# Altium schematic sheet Ethernet1_PoE.SchDoc
size A3; DocumentNumber: 22; SheetNumber: 22; SheetTotal: 47
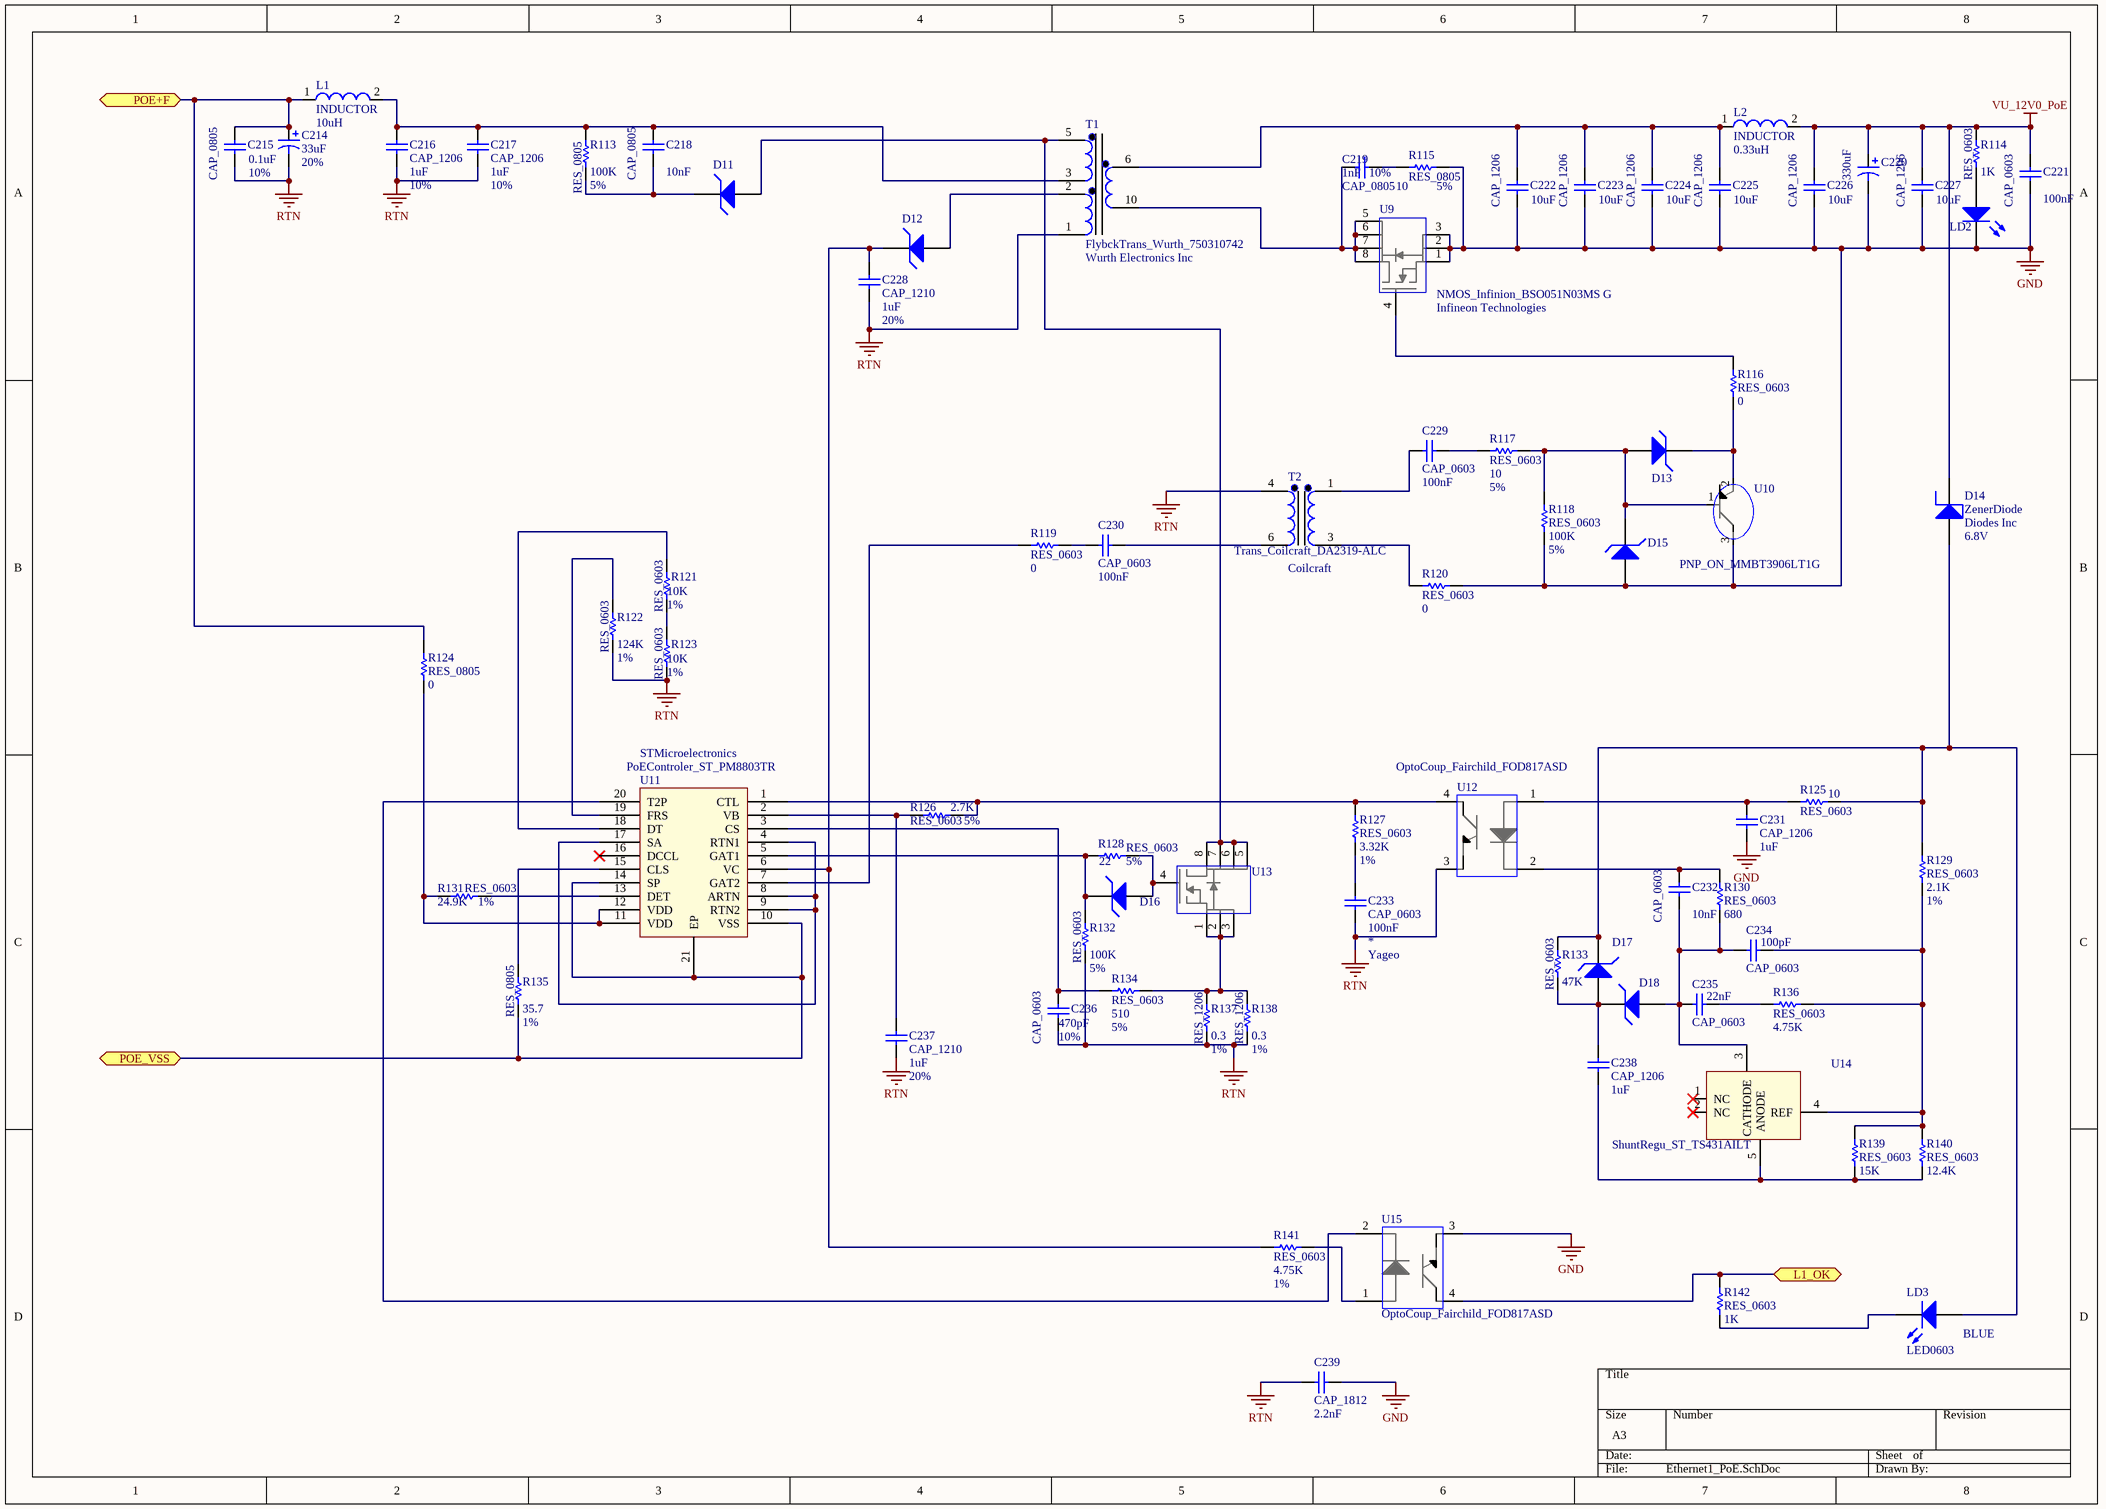
[diagram p0: Ethernet1_PoE.SchDoc]

## Parts
C214  value 33uF  Tolerance: 20%  [CapPol_Al_EEE-2AA330P]  (hidden comment: Cap Pol1)
C215  CAP_0805  value 0.1uF  Tolerance: 10%  [CAPC0805(2012)75_N]
C216  CAP_1206  value 1uF  Tolerance: 10%  [CAPC1206(3216)100_N]
C217  CAP_1206  value 1uF  Tolerance: 10%  [CAPC1206(3216)100_N]
C218  CAP_0805  value 10nF  [CAPC0805(2012)75_N]
C219  CAP_0805  value 1nF  Tolerance: 10%  [CAPC0805(2012)75_N]
C220  value 330uF  [CapPol_Al_PCV1D331MCL2GS]  (hidden comment: Cap Pol1)
C221  CAP_0603  value 100nF  [CAPC0603(1608)100_N]
C222  CAP_1206  value 10uF  [CAPC1206(3216)100_N]
C223  CAP_1206  value 10uF  [CAPC1206(3216)100_N]
C224  CAP_1206  value 10uF  [CAPC1206(3216)100_N]
C225  CAP_1206  value 10uF  [CAPC1206(3216)100_N]
C226  CAP_1206  value 10uF  [CAPC1206(3216)100_N]
C227  CAP_1206  value 10uF  [CAPC1206(3216)100_N]
C228  CAP_1210  value 1uF  Tolerance: 20%  [CAPC1210(3225)100_N]
C229  CAP_0603  value 100nF  [CAPC0603(1608)100_N]
C230  CAP_0603  value 100nF  [CAPC0603(1608)100_N]
C231  CAP_1206  value 1uF  [CAPC1206(3216)100_N]
C232  CAP_0603  value 10nF  [CAPC0603(1608)100_N]
C233  CAP_0603  value 100nF  Manufacturer: Yageo  [CAPC0603(1608)100_N]
C234  CAP_0603  value 100pF  [CAPC0603(1608)100_N]
C235  CAP_0603  value 22nF  [CAPC0603(1608)100_N]
C236  CAP_0603  value 470pF  Tolerance: 10%  [CAPC0603(1608)100_N]
C237  CAP_1210  value 1uF  Tolerance: 20%  [CAPC1210(3225)100_N]
C238  CAP_1206  value 1uF  [CAPC1206(3216)100_N]
C239  CAP_1812  value 2.2nF  [CAPC1812(4532)250_N]
D11  Shottky Diode  [SchottlyDiode_STPS2H100A_SMA]  (value not drawn)
D12  Shottky Diode  [SchottkyDiode_BAT46JFILM]  (value not drawn)
D13  Shottky Diode  [SchottkyDiode_BAT46JFILM]  (value not drawn)
D14  ZenerDiode  value 6.8V  Manufacturer: Diodes Inc  [ZenerDiode_DDZ6V8CSF-7_2-PIN]
D15  Shottky Diode  [SchottkyDiode_BAT46JFILM]  (value not drawn)
D16  Shottky Diode  [SchottkyDiode_BAT46JFILM]  (value not drawn)
D17  Shottky Diode  [SchottkyDiode_BAT46JFILM]  (value not drawn)
D18  Shottky Diode  [SchottkyDiode_BAT46JFILM]  (value not drawn)
L1  INDUCTOR  value 10uH  [Inductor_MSS7341-103MLB_2-PIN]
L2  INDUCTOR  value 0.33uH  [Inductor_DO1813H-181MLB_2-PINS]
LD2  LED0805  [LED0805(2012)]  (value not drawn)
LD3  LED0603  value BLUE  [LED0603(1608)]
R113  RES_0805  value 100K  Tolerance: 5%  [RESC0805(2012)_N]
R114  RES_0603  value 1K  [RESC0603(1608)_N]
R115  RES_0805  value 10  Tolerance: 5%  [RESC0805(2012)_N]
R116  RES_0603  value 0  [RESC0603(1608)_N]
R117  RES_0603  value 10  Tolerance: 5%  [RESC0603(1608)_N]
R118  RES_0603  value 100K  Tolerance: 5%  [RESC0603(1608)_N]
R119  RES_0603  value 0  [RESC0603(1608)_N]
R120  RES_0603  value 0  [RESC0603(1608)_N]
R121  RES_0603  value 10K  Tolerance: 1%  [RESC0603(1608)_N]
R122  RES_0603  value 124K  Tolerance: 1%  [RESC0603(1608)_N]
R123  RES_0603  value 10K  Tolerance: 1%  [RESC0603(1608)_N]
R124  RES_0805  value 0  [RESC0805(2012)_N]
R125  RES_0603  value 10  [RESC0603(1608)_N]
R126  RES_0603  value 2.7K  Tolerance: 5%  [RESC0603(1608)_N]
R127  RES_0603  value 3.32K  Tolerance: 1%  [RESC0603(1608)_N]
R128  RES_0603  value 22  Tolerance: 5%  [RESC0603(1608)_N]
R129  RES_0603  value 2.1K  Tolerance: 1%  [RESC0603(1608)_N]
R130  RES_0603  value 680  [RESC0603(1608)_N]
R131  RES_0603  value 24.9K  Tolerance: 1%  [RESC0603(1608)_N]
R132  RES_0603  value 100K  Tolerance: 5%  [RESC0603(1608)_N]
R133  RES_0603  value 47K  [RESC0603(1608)_N]
R134  RES_0603  value 510  Tolerance: 5%  [RESC0603(1608)_N]
R135  RES_0805  value 35.7  Tolerance: 1%  [RESC0805(2012)_N]
R136  RES_0603  value 4.75K  [RESC0603(1608)_N]
R137  RES_1206  value 0.3  Tolerance: 1%  [RESC1206(3216)_N]
R138  RES_1206  value 0.3  Tolerance: 1%  [RESC1206(3216)_N]
R139  RES_0603  value 15K  [RESC0603(1608)_N]
R140  RES_0603  value 12.4K  [RESC0603(1608)_N]
R141  RES_0603  value 4.75K  Tolerance: 1%  [RESC0603(1608)_N]
R142  RES_0603  value 1K  [RESC0603(1608)_N]
T1  FlybckTrans_Wurth_750310742  Manufacturer: Wurth Electronics Inc  [FlybckTrans_Wurth_750310742_10PinSMD]
T2  Trans_Coilcraft_DA2319-ALC  Manufacturer: Coilcraft  [Trans_Coilcraft_DA2319-ALC_SOP-6]
U9  NMOS_Infinion_BSO051N03MS G  Manufacturer: Infineon Technologies  [NMOS_Infinion_BSO051N03MS G_PG-DSO-8]
U10  PNP_ON_MMBT3906LT1G  [MMBT3906LT1G_SOT23-3]
U11  PoEControler_ST_PM8803TR  Manufacturer: STMicroelectronics  [PoEControler_ST_PM8803TR_HTSSOP20]
U12  OptoCoup_Fairchild_FOD817ASD  [OptoCoup_Fairchild_FOD817ASD_4-SMD]
U13  NMOS_Vishay_SI4848DY-T1-E3  [NMOS_Vishay_SI4848DY-T1-E3_SO-8]  (value not drawn)
U14  ShuntRegu_ST_TS431AILT  [ShuntRegu_ST_TS431AILT_SOT23-5]
U15  OptoCoup_Fairchild_FOD817ASD  [OptoCoup_Fairchild_FOD817ASD_4-SMD]

## Ports
L1_OK, POE+F, POE_VSS

## Nets
GND: C220.2 C221.1 C222.1 C223.1 C224.1 C225.1 C226.1 C227.1 C231.1 C239.2 D15.2(A) LD2.1(K) R115.2 R118.1 R120.2 U9.1 U9.2 U9.3 U10.3 U15.3(Emitter)
RTN: C214.2 C215.1 C216.1 C217.1 C228.1 C233.1 C236.1 C237.1 C239.1 R122.1 R123.1 R132.1 R137.1 R138.1 T1.1 T2.4 U12.3(Emitter)
VU_12V0_PoE: C220.1 C221.2 C226.2 C227.2 D14.1(K) L2.2 R114.2
L1_OK: R142.2 U15.4(Collector) ; port L1_OK
POE+F: C214.1 C215.2 L1.1 R124.2 ; port POE+F
POE_VSS: R135.1 U11.10(VSS) U11.14(SP) U11.21(EP) ; port POE_VSS
NetC216_2: C216.2 C217.2 C218.2 L1.2 R113.2 T1.3
NetC218_1: C218.1 D11.1(K) R113.1
NetC219_1: C219.1 T1.10 U9.5 U9.6 U9.7 U9.8
NetC219_2: C219.2 R115.1
NetC222_2: C222.2 C223.2 C224.2 C225.2 L2.1 T1.6
NetC228_2: C228.2 D12.1(K) R141.1 U11.6(VC)
NetC229_1: C229.1 T2.1
NetC229_2: C229.2 R117.1
NetC230_1: C230.1 R119.2
NetC230_2: C230.2 T2.6
NetC231_2: C231.2 R125.1 U12.1(Anode)
NetC232_1: C232.1 C234.1 C235.1 D18.2(A) R130.1 U14.3(CATHODE)
NetC232_2: C232.2 R130.2 U12.2(Cathode)
NetC233_2: C233.2 R127.1
NetC234_2: C234.2 R129.1 R136.2 R139.2 R140.2 U14.4(REF)
NetC235_2: C235.2 R136.1
NetC236_2: C236.2 R134.1 U11.3(CS)
NetC237_2: C237.2 R126.1 U11.2(VB)
NetC238_1: C238.1 R139.1 R140.1 U14.5(ANODE)
NetC238_2: C238.2 D17.2(A) D18.1(K) R133.1
NetD11_2: D11.2(A) T1.5 U13.5 U13.6 U13.7 U13.8
NetD12_2: D12.2(A) T1.2
NetD13_1: D13.1(K) R116.1 U10.2
NetD13_2: D13.2(A) D15.1(K) R117.2 R118.2 U10.1
NetD14_2: D14.2(A) D17.1(K) LD3.2(A) R125.2 R129.2 R133.2
NetD16_1: D16.1(K) R128.1 R132.2 U11.5(GAT1)
NetD16_2: D16.2(A) R128.2 U13.4
NetLD2_2: LD2.2(A) R114.1
NetLD3_1: LD3.1(K) R142.1
NetR116_2: R116.2 U9.4
NetR119_1: R119.1 U11.7(GAT2)
NetR120_1: R120.1 T2.3
NetR121_1: R121.1 R123.2
NetR121_2: R121.2 U11.18(DT)
NetR122_2: R122.2 U11.19(FRS)
NetR124_1: R124.1 R131.1 U11.11(VDD) U11.12(VDD)
NetR126_2: R126.2 R127.2 U11.1(CTL) U12.4(Collector)
NetR131_2: R131.2 U11.13(DET)
NetR134_2: R134.2 R137.2 R138.2 U13.1 U13.2 U13.3
NetR135_2: R135.2 U11.15(CLS)
NetR141_2: R141.2 U15.1(Anode)
NetU11_4: U11.4(RTN1) U11.8(ARTN) U11.9(RTN2) U11.17(SA)
NetU11_20: U11.20(T2P) U15.2(Cathode)

Not connected (* = marked no-connect by the designer): U11 16(DCCL)*; U14 1(NC)* 2(NC)*

## Library data of the parts
C214 = EEE-2AA330P: CAP ALUM 33UF 100V 20% SMD; Manufacturer: Panasonic Electronic Components; Part Number: EEE-2AA330P; Footprint Ref: CapPol_Al_EEE-2AA330P; Library Ref: Cap Pol1
C215 = C2012X7R2A104K: CAP CER 0.1UF 100V 10% X7R 0805; Manufacturer: TDK Corporation; Part Number: C2012X7R2A104K; Footprint Ref: CAPC0805(2012)75_N; Library Ref: CAP_0805
C216 C217 C231 C238 = C3216X7R2A105K: CAP CER 1UF 100V 10% X7R 1206; Manufacturer: TDK Corporation; Part Number: C3216X7R2A105K; Footprint Ref: CAPC1206(3216)100_N; Library Ref: CAP_1206
  C231 C238: Tolerance: *
C218 = C2012X7R2A103K: CAP CER 10000PF 100V X7R 0805; Manufacturer: TDK Corporation; Tolerance: *; Part Number: C2012X7R2A103K; Footprint Ref: CAPC0805(2012)75_N; Library Ref: CAP_0805
C219 = 101R15W102KV4T: CAP CER 1000PF 100V 10% X7R 0805; Manufacturer: Johanson Dielectrics Inc; Part Number: 101R15W102KV4T; Footprint Ref: CAPC0805(2012)75_N; Library Ref: CAP_0805
C220 = PCV1D331MCL2GS: CAP ALUM 330UF 20V 20% SMD; Manufacturer: Nichicon; Tolerance: *; Part Number: PCV1D331MCL2GS; Footprint Ref: CapPol_Al_PCV1D331MCL2GS; Library Ref: Cap Pol1
C221 C229 C230 = CC0603ZRY5V9BB104: CAP CER 0.1UF 50V Y5V 0603; Manufacturer: Yageo; Tolerance: *; Part Number: CC0603ZRY5V9BB104; Footprint Ref: CAPC0603(1608)100_N; Library Ref: CAP_0603
C222-C227 = TMK316F106ZL-T: CAP CER 10UF 25V Y5V 1206; Manufacturer: Taiyo Yuden; Tolerance: *; Part Number: TMK316F106ZL-T; Footprint Ref: CAPC1206(3216)100_N; Library Ref: CAP_1206
C228 C237 = 160X41W105MV4E: CAP CER 1UF 16V 20% X7R 1210; Manufacturer: Johanson Dielectrics Inc; Part Number: 160X41W105MV4E; Footprint Ref: CAPC1210(3225)100_N; Library Ref: CAP_1210
C232 = C0603C103K5RACTU: CAP CER 10000PF 50V 10% X7R 0603; Manufacturer: Kemet; Tolerance: *; Part Number: C0603C103K5RACTU; Footprint Ref: CAPC0603(1608)100_N; Library Ref: CAP_0603
C233 = CC0603ZRY5V9BB104: CAP CER 0.1UF 50V Y5V 0603; Tolerance: *; Part Number: CC0603ZRY5V9BB104; Footprint Ref: CAPC0603(1608)100_N; Library Ref: CAP_0603
C234 = C0603C101J5GACTU: CAP CER 100PF 50V 5% NP0 0603; Manufacturer: Kemet; Tolerance: *; Part Number: C0603C101J5GACTU; Footprint Ref: CAPC0603(1608)100_N; Library Ref: CAP_0603
C235 = C0603C223K5RACTU: CAP CER 0.022UF 50V 10% X7R 0603; Manufacturer: Kemet; Tolerance: *; Part Number: C0603C223K5RACTU; Footprint Ref: CAPC0603(1608)100_N; Library Ref: CAP_0603
C236 = CC0603KRX7R9BB471: CAP CER 470PF 50V 10% X7R 0603; Manufacturer: Yageo; Part Number: CC0603KRX7R9BB471; Footprint Ref: CAPC0603(1608)100_N; Library Ref: CAP_0603
C239 = C1812C222KGRACTU: CAP CER 2200PF 2KV 10% X7R 1812; Manufacturer: Kemet; Tolerance: *; Part Number: C1812C222KGRACTU; Footprint Ref: CAPC1812(4532)250_N; Library Ref: CAP_1812
D11 = STPS2H100A: DIODE SCHOTTKY PWR 100V 2A SMA; Manufacturer: STMicroelectronics; Part Number: STPS2H100A; Footprint Ref: SchottlyDiode_STPS2H100A_SMA; Library Ref: ShottkyDiode
D12 D13 D15-D18 = BAT46JFILM: IC DIODE SCHOTTKY SS SOD-323; Manufacturer: STMicroelectronics; Part Number: BAT46JFILM; Footprint Ref: SchottkyDiode_BAT46JFILM; Library Ref: ShottkyDiode
D14 = DDZ6V8CSF-7: DIODE ZENER 6.84V 500MW SOD323F; Part Number: DDZ6V8CSF-7; Footprint Ref: ZenerDiode_DDZ6V8CSF-7_2-PIN; Library Ref: ZenerDiode
L1 = MSS7341-103MLB: INDUCTOR, 10uH,DCR 0.038, CURRENT 1.64A; Manufacturer: Coilcraft; Tolerance: *; Part Number: MSS7341-103MLB; Library Ref: INDUCTOR; Footprint Ref: Inductor_MSS7341-103MLB_2-PIN
L2 = DO1813H-181MLB: INDUCTOR, 0.33uH,DCR 0.004, CURRENT 10A; Manufacturer: Coilcraft; Tolerance: *; Part Number: DO1813H-181MLB; Library Ref: INDUCTOR; Footprint Ref: Inductor_DO1813H-181MLB_2-PINS
LD2 = LTST-C171GKT: LED GREEN CLEAR THIN 0805 SMD; Manufacturer: Lite-On Inc; Part Number: LTST-C171GKT; Value: GREEN; Footprint Ref: LED0805(2012); Library Ref: LED0805
LD3 = UT-692NB: Blue, SMD, 0603 Hi Brite; Manufacturer: LightComp LED; Part Number: UT-692NB; Footprint Ref: LED0603(1608); Library Ref: LED0603
R113 = CRCW0805100KJNEA: RES 100K OHM 1/8W 5% 0805 SMD; Manufacturer: Vishay Dale; Part Number: CRCW0805100KJNEA; Footprint Ref: RESC0805(2012)_N; Library Ref: RES_0805
R114 = ERJ-3GEYJ102V: RES 1.0K OHM 1/10W 5% 0603 SMD; Manufacturer: Panasonic Electronic Components; Tolerance: *; Part Number: ERJ-3GEYJ102V; Footprint Ref: RESC0603(1608)_N; Library Ref: RES_0603
R115 = CRCW080510R0JNEA: RES 10 OHM 1/8W 5% 0805 SMD; Manufacturer: Vishay Dale; Part Number: CRCW080510R0JNEA; Footprint Ref: RESC0805(2012)_N; Library Ref: RES_0805
R116 R119 R120 = ERJ-3GEY0R00V: RES 0.0 OHM 1/10W 0603 SMD; Manufacturer: Panasonic Electronic Components; Tolerance: *; Part Number: ERJ-3GEY0R00V; Footprint Ref: RESC0603(1608)_N; Library Ref: RES_0603
R117 R125 = ERJ-3GEYJ100V: RES 10 OHM 1/10W 5% 0603 SMD; Manufacturer: Panasonic Electronic Components; Part Number: ERJ-3GEYJ100V; Footprint Ref: RESC0603(1608)_N; Library Ref: RES_0603
  R125: Tolerance: *
R118 R132 = ERJ-3GEYJ104V: RES 100K OHM 1/10W 5% 0603 SMD; Manufacturer: Panasonic Electronic Components; Part Number: ERJ-3GEYJ104V; Footprint Ref: RESC0603(1608)_N; Library Ref: RES_0603
R121 R123 = ERJ-3EKF1002V: RES 10.0K OHM 1/10W 1% 0603 SMD; Manufacturer: Panasonic Electronics Components; Part Number: ERJ-3EKF1002V; Footprint Ref: RESC0603(1608)_N; Library Ref: RES_0603
R122 = ERJ-3EKF1243V: RES 124K OHM 1/10W 1% 0603 SMD; Manufacturer: Panasonic Electronic Components; Part Number: ERJ-3EKF1243V; Footprint Ref: RESC0603(1608)_N; Library Ref: RES_0603
R124 = CRCW08050000Z0EA: RES 0.0 OHM 1/8W 0805 SMD; Manufacturer: Vishay Dale; Tolerance: *; Part Number: CRCW08050000Z0EA; Footprint Ref: RESC0805(2012)_N; Library Ref: RES_0805
R126 = ERJ-3GEYJ272V: RES 2.7K OHM 1/10W 5% 0603 SMD; Manufacturer: Panasonic Electronic Components; Part Number: ERJ-3GEYJ272V; Footprint Ref: RESC0603(1608)_N; Library Ref: RES_0603
R127 = ERJ-3EKF3321V: RES 3.32K OHM 1/10W 1% 0603 SMD; Manufacturer: Panasonic Electronic Components; Part Number: ERJ-3EKF3321V; Footprint Ref: RESC0603(1608)_N; Library Ref: RES_0603
R128 = ERJ-3GEYJ220V: RES 22 OHM 1/10W 5% 0603 SMD; Manufacturer: Panasonic Electronic Components; Part Number: ERJ-3GEYJ220V; Footprint Ref: RESC0603(1608)_N; Library Ref: RES_0603
R129 = ERJ-3EKF2101V: RES 2.10K OHM 1/10W 1% 0603 SMD; Manufacturer: Panasonic Electronic Components; Part Number: ERJ-3EKF2101V; Footprint Ref: RESC0603(1608)_N; Library Ref: RES_0603
R130 = ERJ-3GEYJ681V: RES 680 OHM 1/10W 5% 0603 SMD; Manufacturer: Panasonic Electronic Components; Tolerance: *; Part Number: ERJ-3GEYJ681V; Footprint Ref: RESC0603(1608)_N; Library Ref: RES_0603
R131 = ERJ-3EKF2492V: RES 24.9K OHM 1/10W 1% 0603 SMD; Manufacturer: Panasonic Electronics Components; Part Number: ERJ-3EKF2492V; Footprint Ref: RESC0603(1608)_N; Library Ref: RES_0603
R133 = ERJ-3GEYJ473V: RES 47K OHM 1/10W 5% 0603 SMD; Manufacturer: Panasonic Electronic Components; Tolerance: *; Part Number: ERJ-3GEYJ473V; Footprint Ref: RESC0603(1608)_N; Library Ref: RES_0603
R134 = ERJ-3GEYJ511V: RES 510 OHM 1/10W 5% 0603 SMD; Manufacturer: Panasonic Electronic Components; Part Number: ERJ-3GEYJ511V; Footprint Ref: RESC0603(1608)_N; Library Ref: RES_0603
R135 = CRCW080535R7FKEA: RES 35.7 OHM 1/8W 1% 0805 SMD; Manufacturer: Vishay Dale; Part Number: CRCW080535R7FKEA; Footprint Ref: RESC0805(2012)_N; Library Ref: RES_0805
R136 R141 = ERJ-3EKF4751V: RES 4.75K OHM 1/10W 1% 0603 SMD; Manufacturer: Panasonic Electronic Components; Part Number: ERJ-3EKF4751V; Footprint Ref: RESC0603(1608)_N; Library Ref: RES_0603
  R136: Tolerance: *
R137 R138 = CSR1206FKR300: RES 0.3OHM 1/2W 1% 1206 SMD; Manufacturer: Stackpole Electronics Inc; Part Number: CSR1206FKR300; Footprint Ref: RESC1206(3216)_N; Library Ref: RES_1206
R139 = ERJ-3GEYJ153V: RES 15K OHM 1/10W 5% 0603 SMD; Manufacturer: Panasonic Electronic Components; Tolerance: *; Part Number: ERJ-3GEYJ153V; Footprint Ref: RESC0603(1608)_N; Library Ref: RES_0603
R140 = RNCP0603FTD12K4: RES 12.4K OHM 1/8W 1% 0603 SMD; Manufacturer: Stackpole Electronics Inc; Tolerance: *; Part Number: RNCP0603FTD12K4; Footprint Ref: RESC0603(1608)_N; Library Ref: RES_0603
R142 = ERJ-3EKF1001V: RES 1.00K OHM 1/10W 1% 0603 SMD; Manufacturer: Panasonic Electronics Components; Tolerance: *; Part Number: ERJ-3EKF1001V; Footprint Ref: RESC0603(1608)_N; Library Ref: RES_0603
T1 = 750310742: TRANS FLYBACK POE+ 38UH SMD; Part Number: 750310742; Footprint Ref: FlybckTrans_Wurth_750310742_10PinSMD; Library Ref: FlybckTrans_Wurth_750310742
T2 = DA2319-ALC: SMT Gate Drive Transmorfer; Part Number: DA2319-ALC; Footprint Ref: Trans_Coilcraft_DA2319-ALC_SOP-6; Library Ref: Trans_Coilcraft_DA2319-ALC
U9 = BSO051N03MS G: MOSFET N-CH 30V 14A DSO-8; Part Number: BSO051N03MS G; Footprint Ref: NMOS_Infinion_BSO051N03MS G_PG-DSO-8; Library Ref: NMOS_Infinion_BSO051N03MS G
U10 = MMBT3906LT1G: TRANS GP SS PNP 40V SOT23; Manufacturer: ON Semiconductor; Part Number: MMBT3906LT1G; Footprint Ref: MMBT3906LT1G_SOT23-3; Library Ref: PNP_ON_MMBT3906LT1G
U11 = PM8803TR: IC POE-PD/PWM CTLR 20-HTSSOP; Part Number: PM8803TR; Footprint Ref: PoEControler_ST_PM8803TR_HTSSOP20; Library Ref: PoEControler_ST_PM8803TR
U12 U15 = FOD817ASD: OPTOCOUPLER PHOTOTRANS OUT 4-SMD; Manufacturer: Fairchild Optoelectronics Group; Part Number: FOD817ASD; Footprint Ref: OptoCoup_Fairchild_FOD817ASD_4-SMD; Library Ref: OptoCoup_Fairchild_FOD817ASD
U13 = SI4848DY-T1-E3: MOSFET N-CH 150V 2.7A 8-SOIC; Manufacturer: Vishay Siliconix; Part Number: SI4848DY-T1-E3; Footprint Ref: NMOS_Vishay_SI4848DY-T1-E3_SO-8; Library Ref: NMOS_Vishay_SI4848DY-T1-E3
U14 = TS431AILT: IC VREF SHUNT PREC ADJ SOT-23-5; Manufacturer: STMicroelectronics; Part Number: TS431AILT; Footprint Ref: ShuntRegu_ST_TS431AILT_SOT23-5; Library Ref: ShuntRegu_ST_TS431AILT